# EAGLE design DotStix (EAGLE 9.3.0)

## Sheet 1 of 2
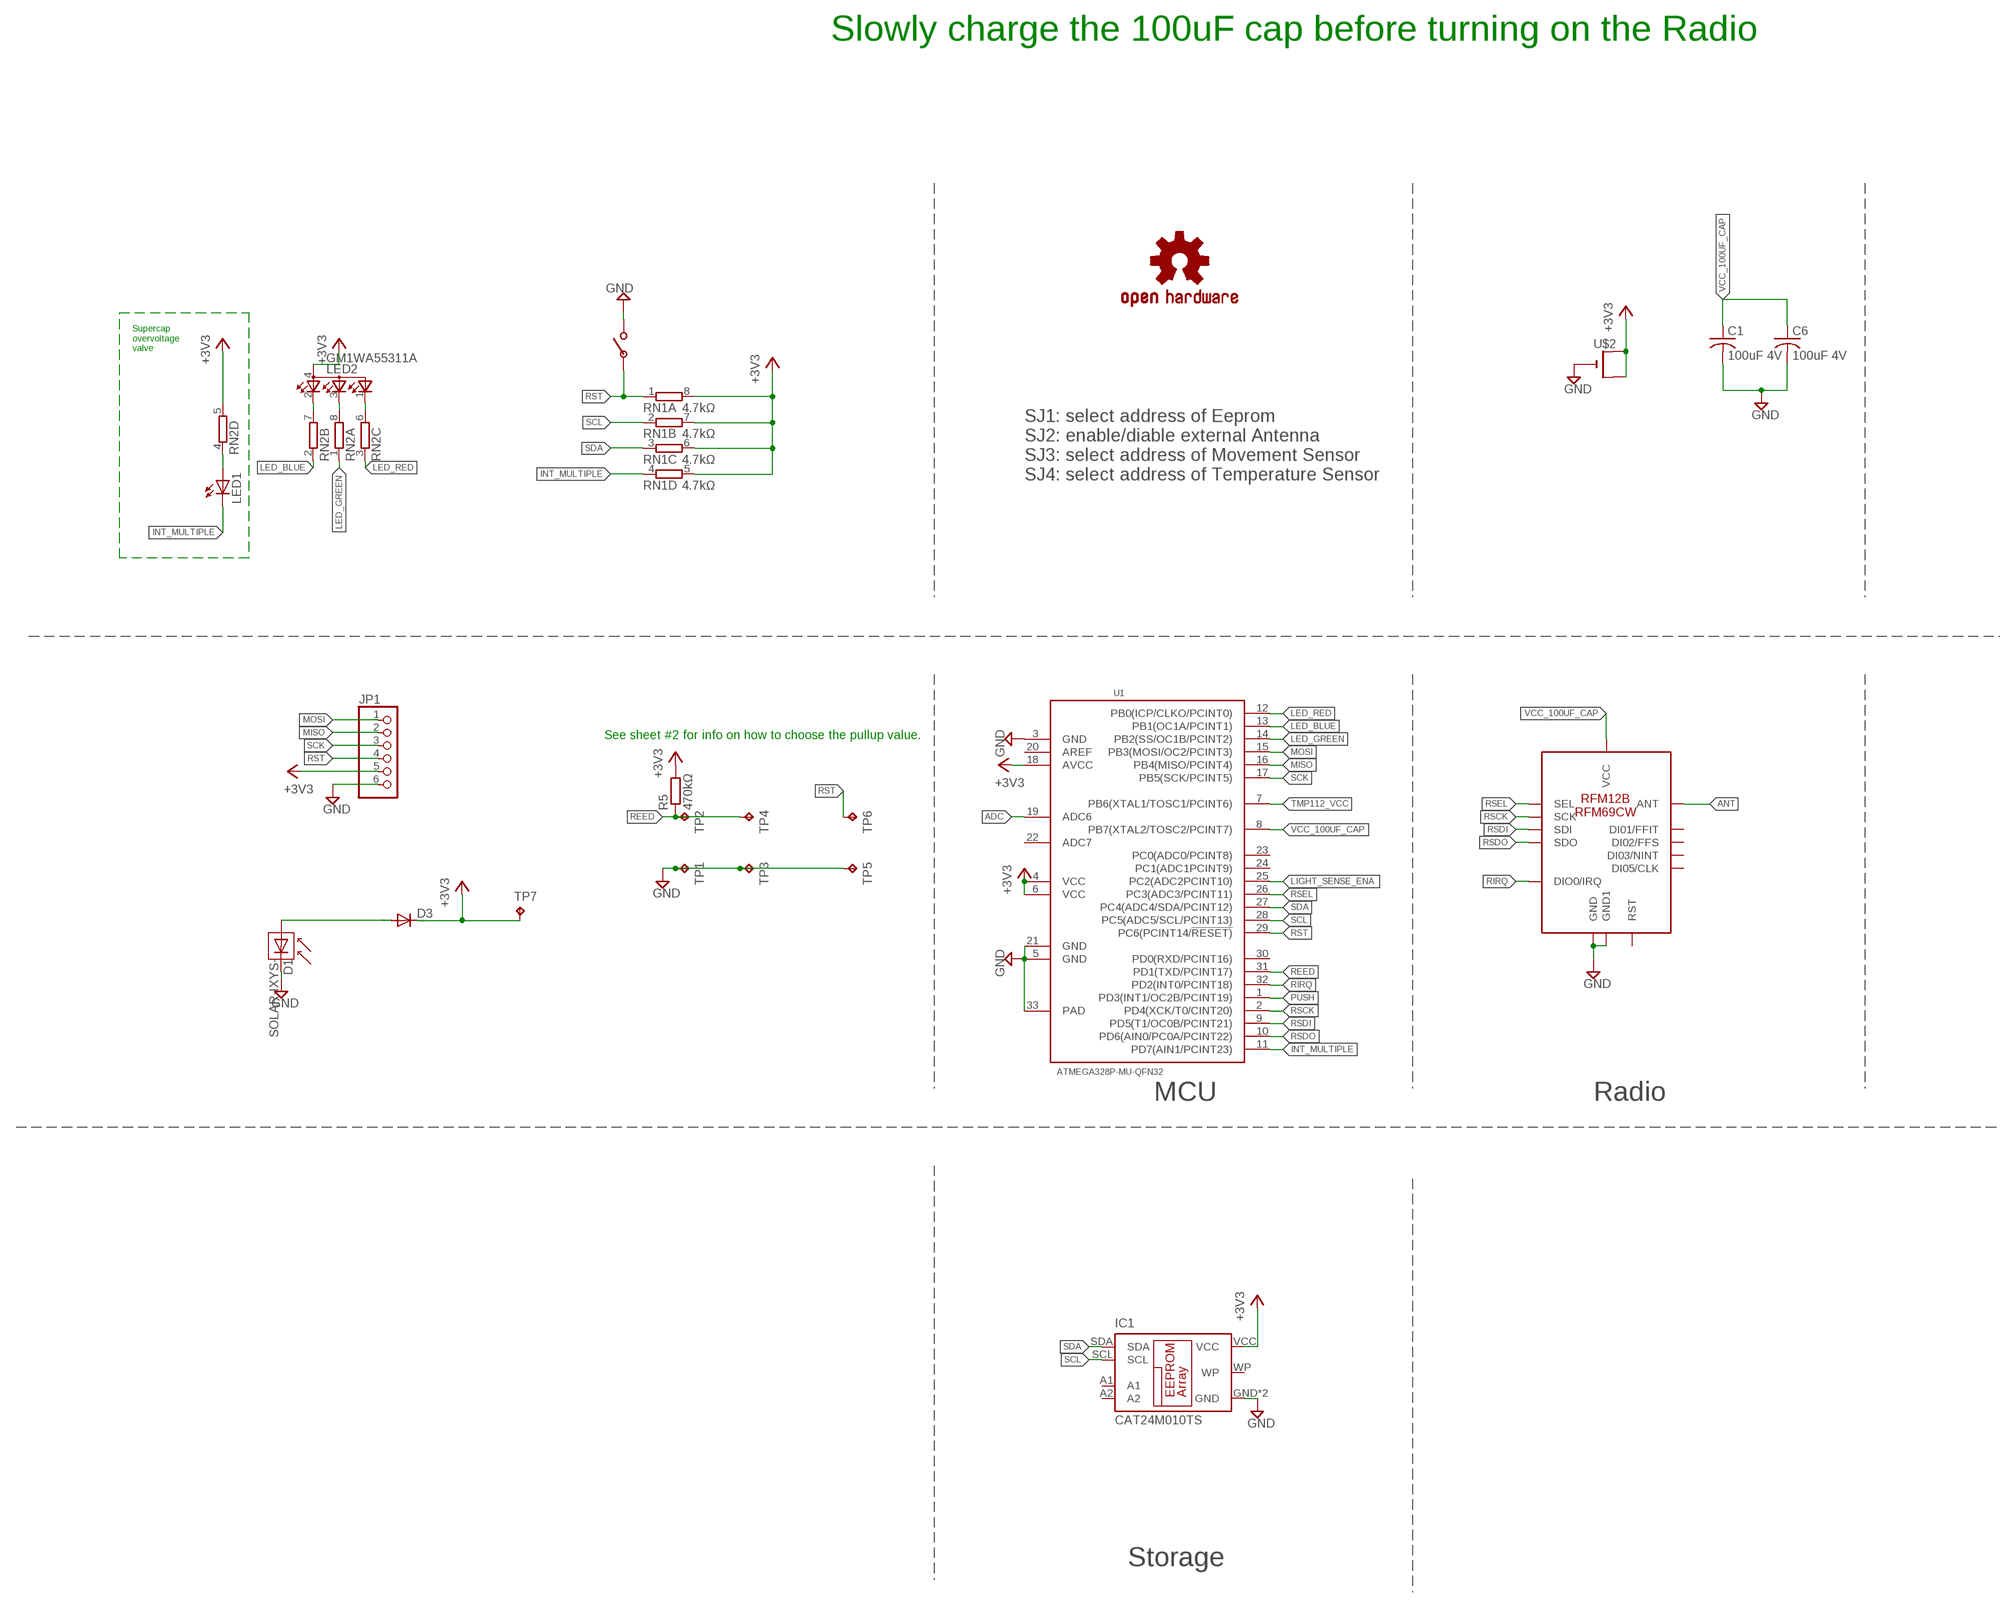
[diagram p0: schematic, sheet 1, part 1 of 2]
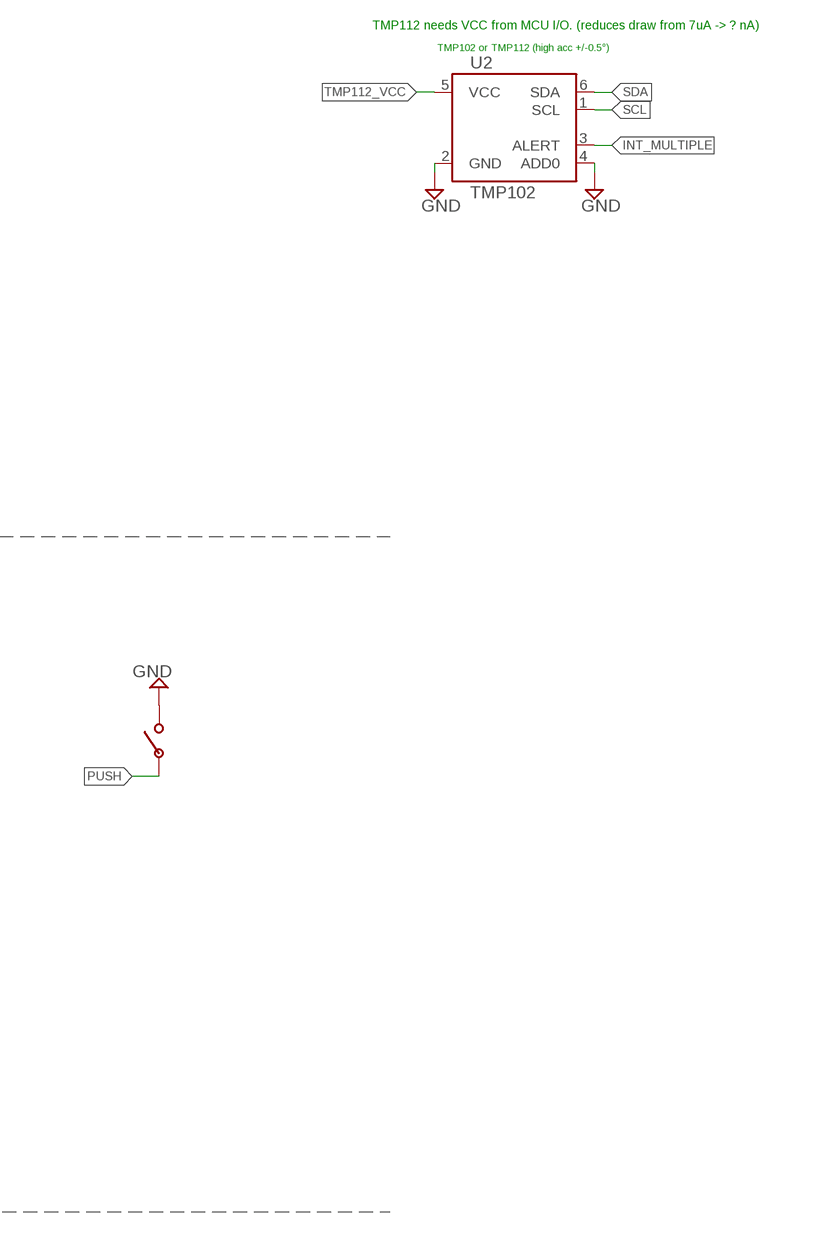
[diagram p1: schematic, sheet 1, part 2 of 2]

### Parts
C1  100uF 4V  C-USC3216  [C3216]
C6  100uF 4V  C-USC3216  [C3216]
D1  SOLAR-IXYS-  [SOLARBIT-12X1]
D3  DIODE-SOD523  [SOD523]
IC1  CAT24M010TS  [TSSOP8]
JP1  PINHD-1X6  [1X06]
LED1  LEDCHIP-LED0603  [CHIP-LED0603]
LED2  GM1WA55311A  [GM1WA55311A]
LOGO1  OSHW-LOGOS  [OSHW-LOGO-S]
R5  470kΩ  R-EU_R0603  [R0603]
RN1  4.7kΩ  4R-N0402ARV341  [4X0402ARV341]
RN2  4R-N0402ARV341  [4X0402ARV341]
TP1  TPTP20SQ  [TP20SQ]
TP2  TPTP20SQ  [TP20SQ]
TP3  TPTP20SQ  [TP20SQ]
TP4  TPTP20SQ  [TP20SQ]
TP5  TPTP20SQ  [TP20SQ]
TP6  TPTP20SQ  [TP20SQ]
TP7  TPTP20SQ  [TP20SQ]
U1  ATMEGA328P-MU-QFN32  MCU-ATMEGA328P-MU(QFN32)  [QFN32G-0.5-5X5MM]
U2  TMP102  [SOT563]
U$1  RFM12B/69CW  [RFM12B/69CW]
U$2  CR1220SMT  [CR1220-SMD]
U$3  PUSHBUTTON_4X2.5  [PUSHBUTTON_4X2.5]
U$4  PUSHBUTTON_4X2.5  [PUSHBUTTON_4X2.5]

### Nets
+3V3: D3.C IC1.VCC JP1.5 LED2.4(A) R5.2 RN1.5 RN1.6 RN1.7 RN1.8 RN2.5 TP7.TP U1.4(VCC) U1.6(VCC) U1.18(AVCC) U$2.+$1(+) U$2.+$2(+1)
ADC: U1.19(ADC6)
ANT: U$1.ANT
GND: C1.2 C6.2 D1.-(C) IC1.GND IC1.NC(GND) JP1.6 TP1.TP TP3.TP TP5.TP U1.3(GND) U1.5(GND) U1.21(GND) U1.33(PAD) U2.2(GND) U2.4(ADD0) U$1.GND U$1.GND1 U$2.- U$3.P$2 U$4.P$2
INT_MULTIPLE: LED1.C RN1.4 U1.11(PD7(AIN1/PCINT23)) U2.3(ALERT)
LED_BLUE: RN2.2 U1.13(PB1(OC1A/PCINT1))
LED_GREEN: RN2.1 U1.14(PB2(SS/OC1B/PCINT2))
LED_RED: RN2.3 U1.12(PB0(ICP/CLKO/PCINT0))
LIGHT_SENSE_ENA: U1.25(PC2(ADC2PCINT10))
MISO: JP1.2 U1.16(PB4(MISO/PCINT4))
MOSI: JP1.1 U1.15(PB3(MOSI/OC2/PCINT3))
N$1: LED2.2(CRED) RN2.7
N$2: D1.+(A) D3.A
N$3: LED2.3(CBLUE) RN2.8
N$4: LED2.1(CGREEN) RN2.6
N$5: LED1.A RN2.4
PUSH: U1.1(PD3(INT1/OC2B/PCINT19)) U$4.P$1
REED: R5.1 TP2.TP TP4.TP U1.31(PD1(TXD/PCINT17))
RIRQ: U1.32(PD2(INT0/PCINT18)) U$1.IRQ(DIO0/IRQ)
RSCK: U1.2(PD4(XCK/T0/CINT20)) U$1.SCK
RSDI: U1.9(PD5(T1/OC0B/PCINT21)) U$1.SDI
RSDO: U1.10(PD6(AIN0/PC0A/PCINT22)) U$1.SDO
RSEL: U1.26(PC3(ADC3/PCINT11)) U$1.SEL
RST: JP1.4 RN1.1 TP6.TP U1.29(PC6(PCINT14/!RESET)) U$3.P$1
SCK: JP1.3 U1.17(PB5(SCK/PCINT5))
SCL: IC1.SCL RN1.2 U1.28(PC5(ADC5/SCL/PCINT13)) U2.1(SCL)
SDA: IC1.SDA RN1.3 U1.27(PC4(ADC4/SDA/PCINT12)) U2.6(SDA)
TMP112_VCC: U1.7(PB6(XTAL1/TOSC1/PCINT6)) U2.5(VCC)
VCC_100UF_CAP: C1.1 C6.1 U1.8(PB7(XTAL2/TOSC2/PCINT7)) U$1.VDD(VCC)
Unconnected: IC1.A1 IC1.A2 IC1.WP U1.20(AREF) U1.22(ADC7) U1.23(PC0(ADC0/PCINT8)) U1.24(PC1(ADC1PCINT9)) U1.30(PD0(RXD/PCINT16)) U$1.CLK(DI05/CLK) U$1.FFIT(DI01/FFIT) U$1.FFS(DI02/FFS) U$1.NINT(DI03/NINT) U$1.RST

### Notes on the sheet
- Slowly charge the 100uF cap before turning on the Radio
- TMP112 needs VCC from MCU I/O. (reduces draw from 7uA -> ? nA)
- TMP102 or TMP112 (high acc +/-0.5°)
- Supercap
  overvoltage
  valve
- SJ1: select address of Eeprom
  SJ2: enable/diable external Antenna
  SJ3: select address of Movement Sensor
  SJ4: select address of Temperature Sensor
- See sheet #2 for info on how to choose the pullup value.
- MCU | Radio
- Storage

## Sheet 2 of 2
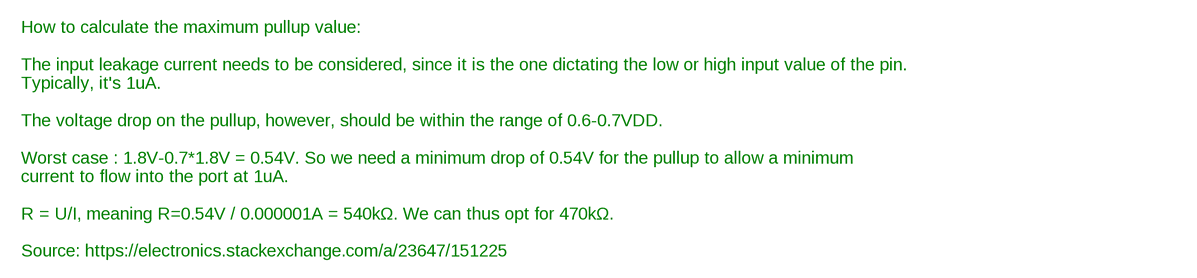
[diagram p2: schematic, sheet 2]

### Notes on the sheet
- How to calculate the maximum pullup value:
  
  The input leakage current needs to be considered, since it is the one dictating the low or high input value of the pin.
  Typically, it's 1uA. 
  
  The voltage drop on the pullup, however, should be within the range of 0.6-0.7VDD. 
  
  Worst case : 1.8V-0.7*1.8V = 0.54V. So we need a minimum drop of 0.54V for the pullup to allow a minimum
  current to flow into the port at 1uA.
  
  R = U/I, meaning R=0.54V / 0.000001A = 540kΩ. We can thus opt for 470kΩ.
  
  Source: https://electronics.stackexchange.com/a/23647/151225

## Library data of the parts
C1 C6 = adafruit:C-US: CAPACITOR, American symbol
D1 = SparkFun:SOLAR-IXYS
D3 = diode:DIODE-: DIODE
IC1 = CAT24M01YI:CAT24M01: Serial EEPROM 1Mb, I2C; MF: On Semiconductor; MPN: 24C00T-E/ST
JP1 = adafruit:PINHD-1X6: PIN HEADER
LED1 = led:LED: LED OSRAM: - CHIPLED LG R971, LG N971, LY N971, LG Q971, LY Q971, LO R971, LY R971 LH N974, LH R974 LS Q976, LO Q976, LY Q976 LO Q996 - Hyper CHIPLED LW Q18S LB Q993, LB Q99A, LB R99A - SideLED LS A670, LO A670, LY A670, LG A670, LP A670 LB A673, LV A673, LT A673, LW A673 LH A674 LY A675 LS A676, LA A676, LO A676, LY A676, LW A676 LS A679, LY A679, LG A679 - Hyper Micro SIDELED® LS Y876, LA Y876, LO Y876, LY Y876 LT Y87S - SmartLED LW L88C, LW L88S LB L89C, LB L89S, LG L890 LS L89K, LO L89K, LY L89K LS L896, LA L896, LO L896, LY L896 - TOPLED LS T670, LO T670, LY T670, LG T670, LP T670 LSG T670, LSP T670, LSY T670, LOP T670, LYG T670 LG T671, LOG T671, LSG T671 LB T673, LV T673, LT T673, LW T673 LH T674 LS T676, LA T676, LO T676, LY T676, LB T676, LH T676, LSB T676, LW T676 LB T67C, LV T67C, LT T67C, LS T67K, LO T67K, LY T67K, LW E67C LS E67B, LA E67B, LO E67B, LY E67B, LB E67C, LV E67C, LT E67C LW T67C LS T679, LY T679, LG T679 LS T770, LO T770, LY T770, LG T770, LP T770 LB T773, LV T773, LT T773, LW T773 LH T774 LS E675, LA E675, LY E675, LS T675 LS T776, LA T776, LO T776, LY T776, LB T776 LHGB T686 LT T68C, LB T68C - Hyper Mini TOPLED® LB M676 - Mini TOPLED Santana® LG M470 LS M47K, LO M47K, LY M47K Source: http://www.osram.convergy.de LUXEON: - LUMILED® LXK2-PW12-R00, LXK2-PW12-S00, LXK2-PW14-U00, LXK2-PW14-V00 LXK2-PM12-R00, LXK2-PM12-S00, LXK2-PM14-U00 LXK2-PE12-Q00, LXK2-PE12-R00, LXK2-PE12-S00, LXK2-PE14-T00, LXK2-PE14-U00 LXK2-PB12-K00, LXK2-PB12-L00, LXK2-PB12-M00, LXK2-PB14-N00, LXK2-PB14-P00, LXK2-PB14-Q00 LXK2-PR12-L00, LXK2-PR12-M00, LXK2-PR14-Q00, LXK2-PR14-R00 LXK2-PD12-Q00, LXK2-PD12-R00, LXK2-PD12-S00 LXK2-PH12-R00, LXK2-PH12-S00 LXK2-PL12-P00, LXK2-PL12-Q00, LXK2-PL12-R00 Source: www.luxeon.com KINGBRIGHT: KA-3528ASYC Source: www.kingbright.com
LED2 = led:GM1WA55311A: Chip LED RGB Source: http://document.sharpsma.com/files/GM1WA55311A_SS.pdf
LOGO1 = Particle-Devices:OSHW-LOGO: Open Source Hardware Logo This logo indicates the piece of hardware it is found on incorporates a OSHW license and/or adheres to the definition of open source hardware found here: http://freedomdefined.org/OSHW
R5 = resistor:R-EU_: RESISTOR, European symbol
RN1 RN2 = resistor-dil:4R-N: Array Chip Resistor Source: RS Component / Phycomp; OC_FARNELL: unknown; OC_NEWARK: unknown
TP1-TP7 = testpad:TP: Test pad
U1 = Seeed-OPL-ic:MCU-ATMEGA328P-MU(QFN32): 310010005; MPN: ATMEGA328P-MU
U2 = SparkFun:TMP102
U$1 = rfm12b_withoutPlanes:RFM12B/69CW
U$2 = adafruit:CR1220: CR1216/CR1220/CR1225 12mm 3V lithium coin cell Great for battery packup. Both SMT and THM holders. Note the THM package has the ground pads on both sides of the PCB so that the masks are the same - this reduces the cost
U$3 U$4 = pusbbutton_4x2_5:PUSHBUTTON_4X2.5

## Board
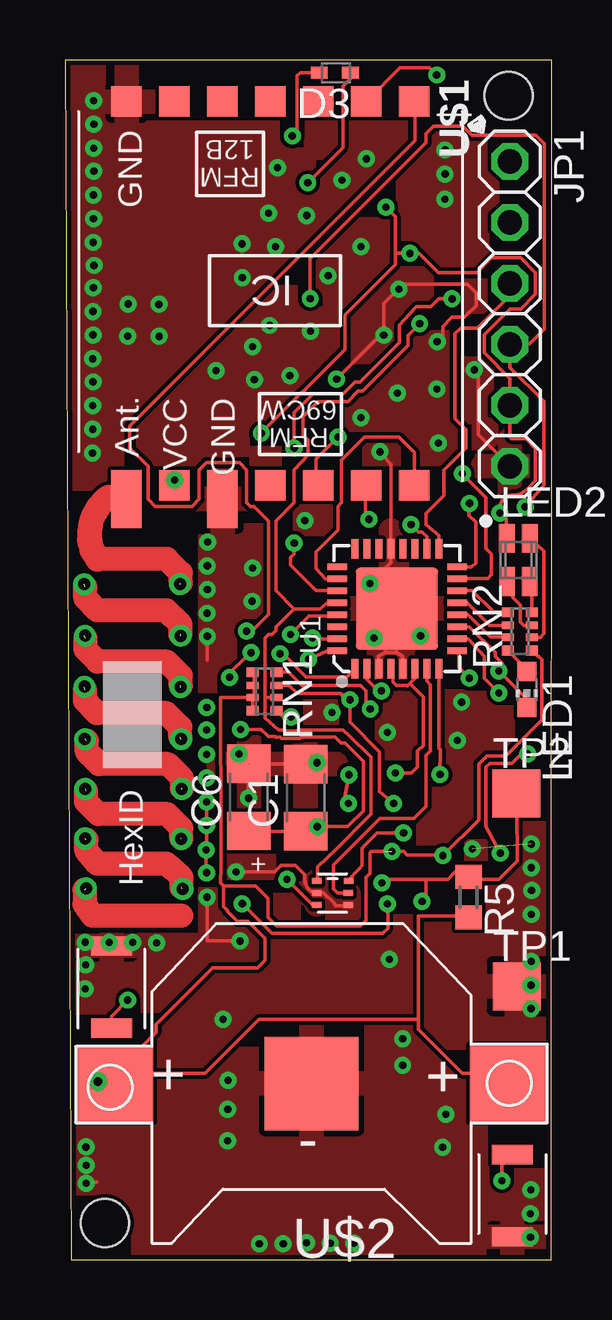
[diagram p3: board, top side]
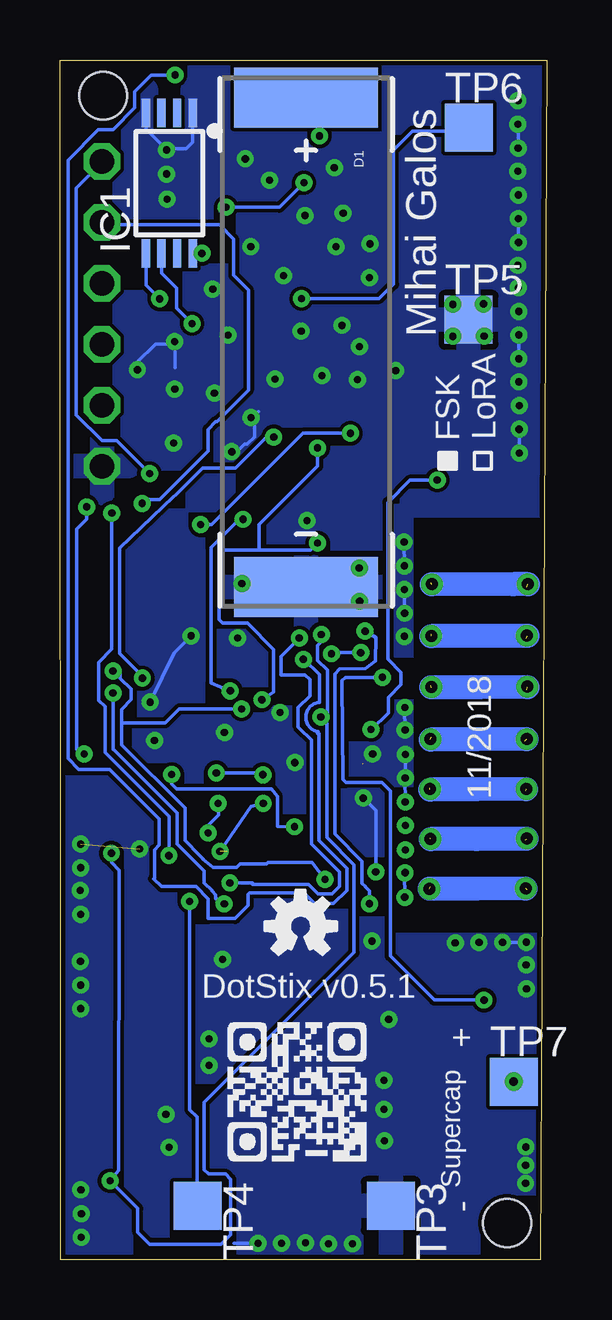
[diagram p4: board, bottom side, seen from below]

Size 20.29 x 50 mm. Coordinates in mm from the lower left corner, seen from the top.
Outline: 0.25,0 20.27,0 20.3,50 0,50 0.25,0
Copper layers (1*16): Top 0.035mm / dielectric 1.5mm / Bottom 0.035mm
Design rules "default": minimum track width 6mil, minimum drill 0.3mm, track to track 6mil, track to pad 6mil, pad to pad 6mil, via to via 6mil, smd to smd 6mil, copper to edge 8mil, drill to drill 8mil, minimum pad ring 10mil, minimum via ring 8mil, stop-mask expansion 4mil, vias tented up to drill 0mil, thermal gap 10mil
Holes 2 mm at 18.49,48.51 1.65,1.52
tRestrict: area 0.3,13.6 to 5.5,30.9
bRestrict: area 0.3,13.6 to 5.5,30.9
vRestrict: area 11.1,24.4 to 16.5,29.9

### Footprints (pad centres in the part's own frame; a part is rotated, then mirrored left to right if it is on the bottom)
C3216 = smd 1.6 x 1.8: 1 -1.4,0; 2 1.4,0
SOLARBIT-12X1 = smd 2.5 x 6: + -10.2,0; - 10.2,0
SOD523 = smd 0.7 x 0.5: A 0.7,0; C -0.6,0
TSSOP8 = smd 1.2 x 0.35: A1 -2.925,1.595; A2 -2.925,0.945; GND -2.925,0.295; NC -2.925,2.245; SCL 2.925,0.945; SDA 2.925,0.295; VCC 2.925,2.245; WP 2.925,1.595
1X06 = drill 1.016 octagon: 1 -6.35,0; 2 -3.81,0; 3 -1.27,0; 4 1.27,0; 5 3.81,0; 6 6.35,0
CHIP-LED0603 = smd 0.8 x 0.8: A 0,-0.75; C 0,0.75
GM1WA55311A = smd 0.65 x 1.2: 1 0.477,0.9; 2 -0.475,-0.9; 3 0.475,-0.9; 4 -0.477,0.9
R0603 = smd 1 x 1.1: 1 -0.85,0; 2 0.85,0
4X0402ARV341 = smd 0.4 x 0.5: 1 -0.8,-0.5; 4 0.8,-0.5; 5 0.8,0.5; 8 -0.8,0.5 | smd 0.3 x 0.5: 2 -0.25,-0.5; 3 0.25,-0.5; 6 0.25,0.5; 7 -0.25,0.5
TP20SQ = smd 2 x 2: TP 0,0
QFN32G-0.5-5X5MM = smd 0.813 x 0.279: 1 -2.5,1.75; 2 -2.5,1.25; 3 -2.5,0.75; 4 -2.5,0.25; 5 -2.5,-0.25; 6 -2.5,-0.75; 7 -2.5,-1.25; 8 -2.5,-1.75; 17 2.5,-1.75; 18 2.5,-1.25; 19 2.5,-0.75; 20 2.5,-0.25; 21 2.5,0.25; 22 2.5,0.75; 23 2.5,1.25; 24 2.5,1.75 | smd 0.279 x 0.813: 9 -1.75,-2.5; 10 -1.25,-2.5; 11 -0.75,-2.5; 12 -0.25,-2.5; 13 0.25,-2.5; 14 0.75,-2.5; 15 1.25,-2.5; 16 1.75,-2.5; 25 1.75,2.5; 26 1.25,2.5; 27 0.75,2.5; 28 0.25,2.5; 29 -0.25,2.5; 30 -0.75,2.5; 31 -1.25,2.5; 32 -1.75,2.5 | smd 3.429 x 3.429: 33 0,0
SOT563 = smd 0.25 x 0.4: 1 -0.5,-0.66; 2 0,-0.66; 3 0.5,-0.66; 4 0.5,0.66; 5 0,0.66; 6 -0.5,0.67
RFM12B/69CW = smd 2.413 x 1.27: ANT 9.06,-6; GND 9.06,-2 | smd 1.27 x 1.27: CLK -7.5,-2; FFIT -7.5,0; FFS -7.5,2; GND1 -7.5,-6; IRQ -7.5,4; NINT 8.5,0; RST -7.5,-4; SCK 8.5,4; SDI 8.5,2; SDO -7.5,6; SEL 8.5,6; VDD 8.5,-4
CR1220-SMD = smd 3.2 x 3.2: +$1 -8.2,0; +$2 8.2,0 | smd 3.9 x 3.9: - 0,0
PUSHBUTTON_4X2.5 = smd 0.8 x 1.7: P$1 -1.27,0; P$2 2.159,0

### Placement (x,y rotation side)
C1  10.03,19.25 90 top
C6  7.66,19.27 90 top
D1  10.03,38.23 270 bottom
D3  11.3,49.47 180 top
IC1  17.01,44.87 270 bottom
JP1  18.54,39.42 270 top
LED1  19.25,23.76 180 top
LED2  18.9,29.17 0 top
LOGO1  10.26,13.89 0 bottom
R5  16.82,15.11 270 top
RN1  8.32,23.68 90 top
RN2  18.97,26.19 270 top
TP1  18.83,11.39 0 top
TP2  18.82,19.43 0 top
TP3  6.5,2.24 270 bottom
TP4  14.55,2.24 270 bottom
TP5  3.25,39.18 0 bottom
TP6  3.25,47.17 0 bottom
TP7  1.37,7.42 0 bottom
U1  13.84,27.13 90 top
U2  11.15,15.28 270 top
U$1  8.56,40.77 270 top
U$2  10.27,7.34 180 top
U$3  18.65,3.11 270 top
U$4  1.94,10.92 90 top

### Tracks (layer width: path | path; a pad name or v marks a point on that pad's centre or on a via)
+3V3  (via drill 0.3, 0.35)  (1 unrouted)
  Top 0.152: LED2.4 18.39,30.18 18.39,30.86 v18.13,31.12 18.13,31.35 arc-90 18.64,31.86 arc46 19.24,32.11 19.61,32.47 19.61,33.81 19.2,34.22 18.62,34.22 18.54,34.29 JP1.5 18.54,36.73 17.48,37.8 17.48,38.56 18.54,39.62 19,39.62 19.61,40.23 19.61,41.15 19,41.76 17.78,41.76 17.17,41.15 15.55,41.15 IC1.VCC v14.38,41.94 13.78,41.94 13.77,41.93 | v14.43,30.63 14.73,30.33 14.88,30.33 15.08,30.14 15.08,29.69 U1.18 | 14.28,23.93 13.82,23.93 13.66,24.08 13.66,24.54 U1.4 | U1.6 14.58,24.54 14.58,24.23 14.37,24.02 | RN1.7 7.87,23.47 7.87,23.93 RN1.6 7.87,24.08 7.87,24.38 RN1.5 | RN1.7 7.76,23.42 6.49,23.42 6.49,23.43 6.49,17.73 6.49,16.4 6.49,15.7 6.61,15.57 | R5.2 16.71,14.33 14.73,14.33 14.73,10.09 | 14.73,10.09 14.73,9.6 16.56,7.77 18.39,7.77 U$2.+$1 | 13.33,17.01 13.19,17 12.76,17 12.71,16.96 12.71,16.1 12.54,15.93 12.54,14.13 12.32,13.91 8.82,13.91 8.45,14.27 8.45,15.06 7.95,15.57 6.61,15.57 | D3.C 11.89,49.23 11.57,48.91 11.57,46.35 v10.12,44.89 | v13.37,43.86 13.77,43.47 13.77,41.93 | 2.08,7.77 U$2.+$2 1.45,7.34 TP7.TP | 2.08,7.77 5.85,7.77 8.08,10.01 14.65,10.01 14.73,10.09 | 2.08,7.77 3.79,9.47 3.79,9.8 6.14,12.16 8.01,12.16 8.34,12.48 8.34,13.39 7.63,14.09 7.18,14.09 6.76,14.51 6.76,14.55 6.61,14.71 6.61,15.57 | 14.26,23.92 14.28,23.93 | 13.77,41.93 13.77,41.46 11.66,39.36 11.66,37.93 v8.18,34.44 | RN1.8 RN1.7 | 14.37,24.02 14.28,23.93 | v11.83,20.21 11.62,19.1 v11.82,19.01 | 13.63,16.92 v13.63,17.01 14.12,17.01 14.26,16.87 15.72,16.87 v15.75,16.84 17.25,18.33 17.25,20.66 17.58,20.99 18.38,20.99 19.88,22.5 19.88,25 19.75,25.14 19.72,25.14 RN2.5 | v13.77,20.29 14.45,20.29 14.7,20.54 14.7,21.2 14.93,21.44 14.93,23.46 14.37,24.02
  Bottom 0.152: JP1.5 18.54,35.2 | v14.43,30.63 13.97,30.63 10.16,34.44 v8.18,34.44 | v13.37,43.86 11.14,43.86 v10.12,44.89 | v18.13,31.12 18.13,25.45 18.68,24.89 18.68,23.31 18.42,23.05 18.42,21.14 15.75,18.48 v15.75,16.84 | IC1.VCC v14.38,41.94 | v13.77,20.29 11.66,20.29 v11.83,20.21 | v11.82,19.01 12.33,18.89 v13.63,17.01
  other vias: 1.37,7.42
ANT  (14 unrouted)
  Top 0.152: 1.55,21.16 1.23,20.84 | 1.55,24.51 1.36,24.92 | 1.55,23.14 1.26,22.86 | 1.81,32.01 1.81,31.78 2.24,31.7 2.54,31.7 U$1.ANT
  Top 1: 0.81,15.42 0.81,14.81 1.13,14.35 4.85,14.35 | 4.85,15.53 4.85,15.95 4.44,16.32 4.22,16.5 1.34,16.5 0.88,17.04 0.88,17.49 0.88,17.5 | 4.84,17.57 4.84,17.99 4.26,18.57 1.38,18.57 0.87,19.08 0.87,19.54 0.86,19.55 | 4.87,19.66 4.87,20.07 4.29,20.65 1.41,20.65 1.23,20.84 0.9,21.16 0.9,21.62 0.9,21.63 | 4.79,21.79 4.79,22.2 4.21,22.78 1.33,22.78 1.26,22.86 0.82,23.29 0.82,23.75 0.82,23.76 | 4.82,23.93 4.82,24.34 4.24,24.92 1.36,24.92 0.85,25.43 0.85,25.89 0.84,25.9 | 4.81,26.07 4.81,26.48 4.22,27.06 1.34,27.06 0.84,27.57 0.84,28.03 0.83,28.04 | 4.82,28.21 4.82,28.63 4.24,29.21 1.36,29.21 1.1,29.56 1.35,29.18 0.99,30
  Top 1.016: 1.35,29.18 arc-90 1.81,31.78
  Bottom 0.152: 2.77,24.21 2.77,23.86 | 2.77,25.58 2.77,25.99 | 1.4,27.71 1.4,28.15 | 2.92,15.83 2.92,15.46 | 2.92,17.96 2.92,17.53 | 2.92,19.18 2.92,19.6 | 2.92,21.31 2.92,21.68 | 2.92,23.45 2.92,23.85 | 2.92,22.07 2.92,21.68 | 2.92,19.64 2.92,19.6
  Bottom 1: 0.87,15.47 2.92,15.46 4.88,15.45 | 0.83,17.54 2.92,17.53 4.84,17.52 | 0.85,19.61 2.92,19.6 4.86,19.59 | 0.83,21.69 2.92,21.68 4.84,21.68 | 0.8,23.86 2.77,23.86 2.92,23.85 4.81,23.85 | 0.8,26 1.4,26 2.77,25.99 4.81,25.98 | 0.78,28.15 1.4,28.15 4.79,28.14
GND  (via drill 0.3)  (2 unrouted)
  Top 0.152: v0.88,3.17 0.99,3.1 1.31,3.23 | 13.82,25.3 14.08,25.14 14.08,24.69 U1.5 | 13.36,25.3 13.82,25.3 | 13.36,25.3 13.07,25.15 13.07,24.69 U1.3 | 13.82,25.3 13.82,25.63 | 13.82,25.63 13.82,27.13 | 13.82,27.13 U1.33 | 8.05,21.38 v7.25,21.07 7.65,20.68 | 13.82,27.13 13.76,27.13 v12.71,28.18 13.58,29.06 U1.21 13.59,29.72 13.59,33.13 v13.13,33.67 | JP1.6 17.23,34.38 17.23,36.92 v17.07,37.09 | v14.82,26 14.19,26 13.82,25.63 | 7.24,16.44 v7.12,16.16 8.73,16.16 9,16.43 9.6,16.43 9.99,16.05 9.99,15.84 arc84 U2.2 10.78,15.28 11.22,14.84 11.22,14.8 11.28,14.75 11.78,14.75 U2.4 | v12.88,25.91 13.36,25.43 13.36,25.3 | v11.32,36.7 13.15,38.53 v13.29,38.53 13.29,39.86 14.08,40.66 16.77,40.66 17.14,40.29 17.14,39.77 16.64,39.27 16.14,39.27 15.74,38.88 15.74,38.49 v15.51,38.27 | v5.92,15.11 5.92,13.28 v7.29,13.28 | v5.9,16.12 5.88,16.12 v5.88,17.07 v5.89,17.07 v5.89,18.1 v5.89,19.08 | v5.93,25.98 5.93,24.98 5.91,24.98 | v7.65,19.23 7.65,20.68 | 7.65,20.68 7.67,20.65 C1.2 10.44,20.65 v10.5,20.71
  Bottom 0.152: v0.84,13.23 v1.84,13.23 v1.84,13.22 | v1.17,42.4 v1.17,43.39 v1.18,43.39 | v1.19,46.33 v1.19,47.33 v1.2,47.33 | v1.15,37.55 v1.15,38.54 v1.16,38.54 | v1.14,33.61 v1.14,34.61 v1.15,34.61 | v5.92,26.94 v5.92,27.93 v5.93,27.93 | v5.89,19.08 5.91,20.07 v5.89,20.07 v5.89,21.05 | v5.92,15.11 5.94,16.12 | 5.94,16.12 v5.9,16.12 | v0.87,3.17 v0.88,3.17 | 13.03,0.67 v12.04,0.67 v12.04,0.68 | 15.49,37.19 15.49,37.49 15.49,38.03 15.62,38.17 16.3,38.17 17.07,37.4 v17.07,37.09 | v12.71,28.18 10.53,28.18 D1.- 8.39,28.03 v7.8,27.44 | v16.53,23.23 15.54,25.29 v14.82,26 | v13.13,33.67 12.91,33.67 12.59,33.99 12.49,33.99 12.18,34.29 12.18,35.17 12.01,35.34 | v5.91,23.01 5.93,23.01 v5.9,22.07 | 5.94,16.12 5.97,16.12 | IC1.GND 16.71,47.12 v15.84,46.25 15.8,46.3 15.04,46.3 14.76,46.58 IC1.NC | v5.94,29.91 v5.93,28.91 | v7.12,16.16 7.12,18.71 v7.65,19.23
  other vias: 2.82,13.22 3.81,13.21 1.18,44.37 1.2,45.37 1.19,48.31 1.16,39.52 1.18,40.52 1.2,41.44 1.14,35.59 1.16,36.59 0.84,11.29 0.86,12.28 0.88,3.93 0.87,4.69 11.05,0.68 10.06,0.7 9.09,0.66 8.09,0.66 19.44,16.33 19.43,14.39 19.45,15.39 19.44,17.32 12.34,42.22 12.57,45.88 8.85,45.51 10.97,41.02 8.53,38.94 7.81,38.05 6.29,37.05 7.89,36.68 9.37,36.84 10.23,38.69 10.07,43.52 8.78,42.23 7.39,40.93 7.37,42.34 8.49,43.62 2.6,38.49 3.91,38.48 2.63,39.83 3.91,39.82 13.52,12.51 6.58,10.01 6.79,7.47 6.78,6.26 6.77,4.95 14.07,9.2 14.07,8.1 7.81,28.83 19.43,10.46 19.43,11.44 19.44,12.44 19.41,0.93 19.4,1.91 19.42,2.91 15.84,45.25 15.83,44.2 13.92,40.44 16.36,21.64 16.98,17.12 15.5,36.28 13.85,36.12 15.56,34.04 11.55,44.99 15.88,6.06 15.74,4.68 11.12,22.8 13.44,21.97 9.99,30.8 12.33,35.09
  pour Top: 0.25,50.6 21.45,50.6 21.45,0 0.25,0
  pour Bottom: 0.25,50.8 21.45,50.8 21.45,0 0.25,0
INT_MULTIPLE  (via drill 0.3)
  Top 0.152: U1.11 16.41,26.36 16.87,26.36 17.93,25.3 17.93,25.15 18.24,24.84 18.09,24.69 v18.09,24.54 19.25,23.37 LED1.C | RN1.4 9.31,24.49 9.64,24.16 9.65,24.15 9.81,23.99 9.84,23.98 9.88,23.94 12.31,23.94 12.54,23.71 12.54,23.2 v12.72,22.96 | v9.25,15.85 10.31,14.78 U2.3
  Bottom 0.152: v18.09,24.54 17.78,24.54 17.78,24.23 17.32,23.77 17.32,23.34 17.72,22.94 17.72,22.38 | v9.25,15.85 9.79,16.56 11.55,16.55 11.62,16.55 11.68,16.49 12.78,16.48 12.92,16.34 13.32,16.34 13.49,16.35 13.91,16.35 14.32,16.69 14.47,16.84 14.47,16.85 15.08,17.46 15.08,18.82 17.72,21.45 17.72,22.38 | v12.72,22.96 15.32,22.96 15.9,22.37 17.71,22.37 17.72,22.38
LED_BLUE
  Top 0.152: U1.13 16.41,27.43 16.71,27.43 17.63,26.52 17.63,26.51 17.7,26.44 RN2.2
LED_GREEN
  Top 0.152: 18.24,26.98 18.39,26.98 RN2.1 17.87,26.98 16.96,27.89 16.41,27.89 U1.14
LED_RED
  Top 0.152: U1.12 16.49,26.89 16.79,26.89 17.63,26.06 17.63,26.05 17.74,25.94 RN2.3
MISO  (via drill 0.3)
  Top 0.152: 16.41,28.96 U1.16 16.95,28.87 17.12,29.04 17.12,30.73 16.84,31.02 16.84,31.49 v16.86,31.52
  Bottom 0.152: JP1.2 18.54,43.13 13.64,43.13 13.04,42.53 13.04,41.03 12.43,40.41 12.43,36.24 13.74,34.93 13.8,34.93 14.12,34.6 14.12,33.7 16.14,31.68 16.71,31.68 v16.86,31.52
MOSI  (via drill 0.3)
  Top 0.152: U1.15 16.32,28.4 17.62,28.4 17.78,28.55 17.78,29.41 17.55,29.65 17.55,31.75 16.56,32.74 v16.56,32.77
  Bottom 0.152: v16.56,32.77 17.93,34.14 18.54,34.14 19.61,35.2 19.61,44.65 18.54,45.72 JP1.1
N$1
  Top 0.152: RN2.7 19.13,26.44 18.98,26.57 18.98,27.28 18.67,27.61 18.67,28.06 LED2.2
N$2  (via drill 0.3)
  Top 0.152: D3.A 9.81,49.47 9.68,49.34 9.68,46.89 v9.47,46.84
  Bottom 0.152: v9.47,46.84 9.46,47.86 D1.+
N$3
  Top 0.152: RN2.8 19.46,27.13 19.46,28.19 LED2.3
N$4
  Top 0.152: RN2.6 19.81,25.94 19.96,26.09 19.96,29.53 LED2.1
N$5
  Top 0.152: RN2.4 19.25,24.61 LED1.A
N$16  (via drill 0.5)
  other vias: 4.89,15.45
N$17  (via drill 0.5)
  other vias: 0.87,15.47
N$18  (via drill 0.5)
  other vias: 0.83,17.56
N$19  (via drill 0.5)
  other vias: 0.84,19.62
N$20  (via drill 0.5)
  other vias: 0.82,21.69
N$21  (via drill 0.5)
  other vias: 0.81,23.88
N$22  (via drill 0.5)
  other vias: 0.82,26.01
N$23  (via drill 0.5)
  other vias: 0.79,28.15
N$27  (via drill 0.5)
  other vias: 4.85,17.54
N$28  (via drill 0.5)
  other vias: 4.86,19.61
N$29  (via drill 0.5)
  other vias: 4.84,21.69
N$30  (via drill 0.5)
  other vias: 4.81,23.86
N$31  (via drill 0.5)
  other vias: 4.81,26
N$32  (via drill 0.5)
  other vias: 4.78,28.15
PUSH  (via drill 0.3)
  Top 0.152: U1.1 11.74,24.29 10.04,24.29 9.07,25.25 v8.97,25.25 | v7.75,25.3 6.67,24.28 v6.85,24.27 | v2.61,10.81 1.94,10.14 U$4.P$1
  Bottom 0.152: v8.97,25.25 8.95,25.24 8.96,25.28 8.94,25.3 v7.75,25.3 | v6.85,24.27 8.38,24.27 8.53,24.13 8.53,24.06 8.49,20.01 8.37,19.89 6.86,19.89 6.52,19.54 6.52,12.65 4.68,10.81 v2.61,10.81 2.63,10.81
REED  (via drill 0.3)
  Top 0.152: v10.31,25.91 10.63,25.91 10.68,25.86 11.19,25.86 11.22,25.89 11.23,25.91 U1.31 | 15.04,15.85 15.95,15.85 16.26,16.15 16.56,16.15 16.71,16 R5.1 16.87,15.85 18.09,15.85 18.85,16.61 18.84,18.82 18.84,19.43 TP2.TP | 15.04,15.85 15.04,15.09 v14.88,14.94 | 15.04,15.85 13.37,15.85 v13.21,15.7
  Bottom 0.152: v10.31,25.91 11.07,25.15 11.07,24.37 10.07,24.37 9.88,24.18 9.88,23.5 10.36,23.02 10.36,22.2 10.3,22.15 10.3,22.14 9.81,21.65 9.81,17.33 8.64,16.15 8.64,15.54 8.94,15.24 9.54,15.24 9.94,15.64 12.2,15.64 | v14.88,14.94 14.88,6.25 14.58,5.94 14.58,2.29 TP4.TP | 12.2,15.64 12.26,15.64 12.27,15.64 12.27,15.65 | v13.21,15.7 12.26,15.7 12.2,15.64
RIRQ  (via drill 0.3)
  Top 0.152: v10.15,25.02 10.95,25.39 11.26,25.39 U1.32 | v15.49,49.38 15.19,49.68 13.97,49.68 12.6,48.31 U$1.IRQ
  Bottom 0.152: v15.49,49.38 16.49,49.38 17.18,48.68 17.18,48.17 17.17,48.16 17.17,48.01 18.09,47.09 18.69,47.09 19.96,45.83 19.96,20.88 19.51,20.43 18.23,20.43 16.15,18.36 16.15,17.28 16.36,17.08 16.36,15.91 16.39,15.87 16.07,15.54 14.62,15.54 14.11,15.04 14.11,14.22 12.99,14.22 12.44,14.76 12.44,15.23 12.39,15.28 10.11,15.28 9.69,14.85 8.88,14.85 8.33,15.4 8.33,16.31 9.49,17.47 9.49,20.66 9.49,20.67 9.49,21.92 arc178 9.53,22.01 arc167 9.48,23.22 9.47,23.57 9.48,23.57 9.48,24.39 10.11,25.02 v10.15,25.02
RSCK  (via drill 0.3)
  Top 0.152: U$1.SCK 12.53,32.27 12.53,30.96 12.56,30.96 v12.66,30.86 | U1.2 12.57,24.62 12.57,24.19 12.72,24.04 12.89,23.87 12.96,23.87 v13.19,23.71
  Bottom 0.152: v12.66,30.86 12.82,30.86 14,29.68 14,24.03 v13.19,23.71
RSDI  (via drill 0.3)
  Top 0.152: v11.38,34.29 10.46,33.38 10.46,32.31 U$1.SDI | U1.9 16.41,25.3 16.41,24.68 v16.86,24.23
  Bottom 0.152: v11.38,34.29 11.68,34.29 12.98,33 14.34,33 15.48,31.86 15.55,31.81 17.8,29.65 17.8,25.26 16.86,24.32 v16.86,24.23
RSDO  (via drill 0.3)
  Top 0.152: v18.09,23.62 17.48,24.23 17.48,25.15 16.82,25.86 16.36,25.86 U1.10 | v7.57,26.19 7.57,25.98 8.48,26.89 8.48,30.79 7.87,31.39 7.72,31.39 7.57,31.55 7.57,32.92 7.26,33.22 5.89,33.22 5.59,32.92 5.59,31.7 5.28,31.39 3.76,31.39 3.45,31.7 3.45,33.07 2.69,33.83 2.69,34.75 14.58,46.63 14.58,48.16 U$1.SDO | v7.38,14.83 7.66,14.55 7.67,14.55 8.64,13.59 13.24,13.59 13.45,13.8 v13.45,14.82 v13.44,14.83
  Bottom 0.152: v18.09,23.62 18.09,21.27 18.05,21.27 15.41,18.62 15.41,17.32 15.23,17.16 15.23,17.15 14.29,16.2 14.29,15.71 13.96,15.38 13.96,15.37 13.8,15.21 13.8,15.05 v13.44,14.83 | v7.38,14.83 7.38,15.36 7.56,15.54 7.56,15.55 7.71,15.69 7.71,16.6 8.83,17.73 8.83,24.41 8.64,24.61 7.56,24.63 7.13,24.95 7.12,25.92 v7.57,26.19
RSEL
  Top 0.152: U1.26 10.87,28.37 10.46,28.8 10.46,28.81 10.46,29.48 11.38,30.4 11.38,31.39 11.53,31.55 11.53,33.34 12.47,34.28 13.92,34.28 14.56,33.63 U$1.SEL | 14.58,32.31 U$1.SEL | 14.38,32.44 U$1.SEL
RST  (via drill 0.3)
  Top 0.152: v9.4,26.06 10.16,26.82 11.23,26.82 U1.29 | 18.54,4.27 U$3.P$1 18.21,3.94 v18.21,3.28 | v19.18,31.38 19.95,32.29 19.95,35.78 18.54,37.19 JP1.4 19.35,38.15 19.98,38.78 19.98,46.52 19.63,46.86 16.96,46.86 16.58,47.24 15.35,47.24 15.05,46.94 15.05,46.55 10.22,41.72 v10.22,40.06 | v9.42,22.62 9.08,22.62 RN1.1 | v19.29,21.08 19.02,21.08 18.63,20.69 18.1,20.69 17.7,20.69 17.55,20.54 17.55,18.06 v18.15,16.94
  Bottom 0.152: v9.4,26.06 9.4,25.76 9.55,25.6 9.55,24.98 9.14,24.57 9.14,22.62 v9.42,22.62 9.43,22.62 9.16,22.35 9.16,17.6 8.03,16.46 8.03,12.8 14.28,6.55 14.28,3.75 14.1,3.57 13.39,3.57 13.17,3.35 13.17,1.03 13.57,0.63 16.55,0.63 17.05,1.14 17.05,2.13 v18.21,3.28 17.85,3.72 17.83,16.22 18.15,16.56 v18.15,16.94 | v19.18,31.38 19.17,31.11 19.17,30.88 19.6,30.45 19.6,21.27 19.39,21.07 19.3,21.07 v19.29,21.08 | v10.22,40.06 6.99,40.06 6.39,40.66 6.39,46.25 5.59,47.04 3.38,47.04 TP6.TP
SCK
  Top 0.152: 17.93,40.69 JP1.3 18.54,40.18 17.19,38.83 16.49,38.83 16.26,38.59 16.26,35.05 16.71,34.59 16.71,33.83 15.8,32.92 15.8,31.85 15.04,31.09 15.04,30.63 15.59,30.18 15.59,29.73 U1.17
SCL  (via drill 0.3)
  Top 0.152: 8.34,23.43 8.34,25.91 8.48,26.06 8.64,26.06 8.79,26.21 8.79,26.36 9.55,27.13 | 9.55,27.13 10.62,27.13 10.91,27.38 11.21,27.38 U1.28 | 9.55,27.13 8.79,27.89 8.79,30.79 9.55,31.55 9.55,32.92 10.14,33.54 10.14,34.16 9.92,34.38 9.92,35.15 10.54,35.77 11.78,35.77 12.22,36.2 12.39,36.2 13.06,36.88 14.29,38.1 14.29,38.51 v14.78,39.01 | 8.34,23.43 RN1.2 8.88,23.36 | U2.1 10.52,15.81 10.52,16.37 11.28,17.08 12.75,18.58 12.75,20.95 11.83,21.84 11.59,22.08 9.71,22.08 9.66,22.03 9.18,22.03 9.13,22.08 9.09,22.08 8.91,22.09 8.34,22.57 8.34,23.43
  Bottom 0.152: IC1.SCL 16.06,41.13 15.42,40.49 15.42,39.65 v14.78,39.01
SDA  (via drill 0.3)
  Top 0.152: v9.55,29.87 9.55,29.41 9.4,29.26 9.4,28.96 10.46,27.89 11.23,27.89 U1.27 | v16.13,40.05 15.59,40.05 15.25,39.71 14.65,39.71 14.35,39.41 13.94,38.95 13.94,38.22 12.29,36.58 12.08,36.58 11.6,36.1 10.35,36.1 9.55,35.3 v9.55,33.83 | RN1.3 9.34,23.94 9.69,23.6 11.45,23.6 v11.88,23.34 11.87,22.4 13.1,21.17 13.11,19.51 v13.7,19.01 | U2.6 arc-4 12.27,16.31 12.38,16.43 12.38,17.15 12.54,17.32 13,17.79 v14.11,17.79
  Bottom 0.152: 11.99,29.57 9.86,29.57 v9.55,29.87 | 11.99,29.57 13.51,29.57 13.66,29.41 13.66,26.68 13.5,26.52 12.48,26.52 11.38,25.42 11.38,23.66 v11.88,23.34 | v9.55,33.83 9.55,33.07 11.99,30.63 11.99,29.57 | IC1.SDA 16.71,40.62 v16.13,40.05 | v14.11,17.79 14.27,17.95 13.68,18.54 v13.7,19.01
TMP112_VCC
  Top 0.152: U1.7 15.08,24.11 15.24,23.95 15.24,21.21 15.04,21.01 15.04,18.89 14.55,18.39 13.13,18.39 11.19,16.45 11.19,15.45 11.36,15.28 U2.5
VCC_100UF_CAP  (via drill 0.3)
  Top 0.152: U1.8 15.58,21.31 15.64,21.26 v15.63,20.22 | 7.84,18.04 C6.1 7.68,17.85 C1.1 10.32,17.85 v10.52,18.04 v10.52,18.05 11.77,18.05 12.43,18.71 12.43,20.76 11.67,21.52 11.5,21.52 11.24,21.78 9.83,21.78 9.79,21.73 9.01,21.73 8.96,21.78 8.9,21.78 8.81,21.77 8.79,21.78 8.78,21.78 8.75,21.81 8.47,21.81 8.18,22.1 v7.32,22.1 | U$1.VDD v4.56,32.49
  Bottom 0.152: v4.56,32.49 5.7,32.49 6.63,31.57 6.63,25.03 6.07,24.47 6.07,23.97 6.61,23.43 6.61,22.79 7.31,22.09 v7.31,22.09 v7.32,22.1 | v15.63,20.22 15.63,19.83 15.42,19.62 11.48,19.62 11.23,19.3 11.23,18.05 v10.52,18.04

### Text on the board
tPlace: HexID | + | + | + | -
bPlace: Mihai Galos | LoRA | FSK | 11/2018 | DotStix v0.5.1 | + | Supercap | -